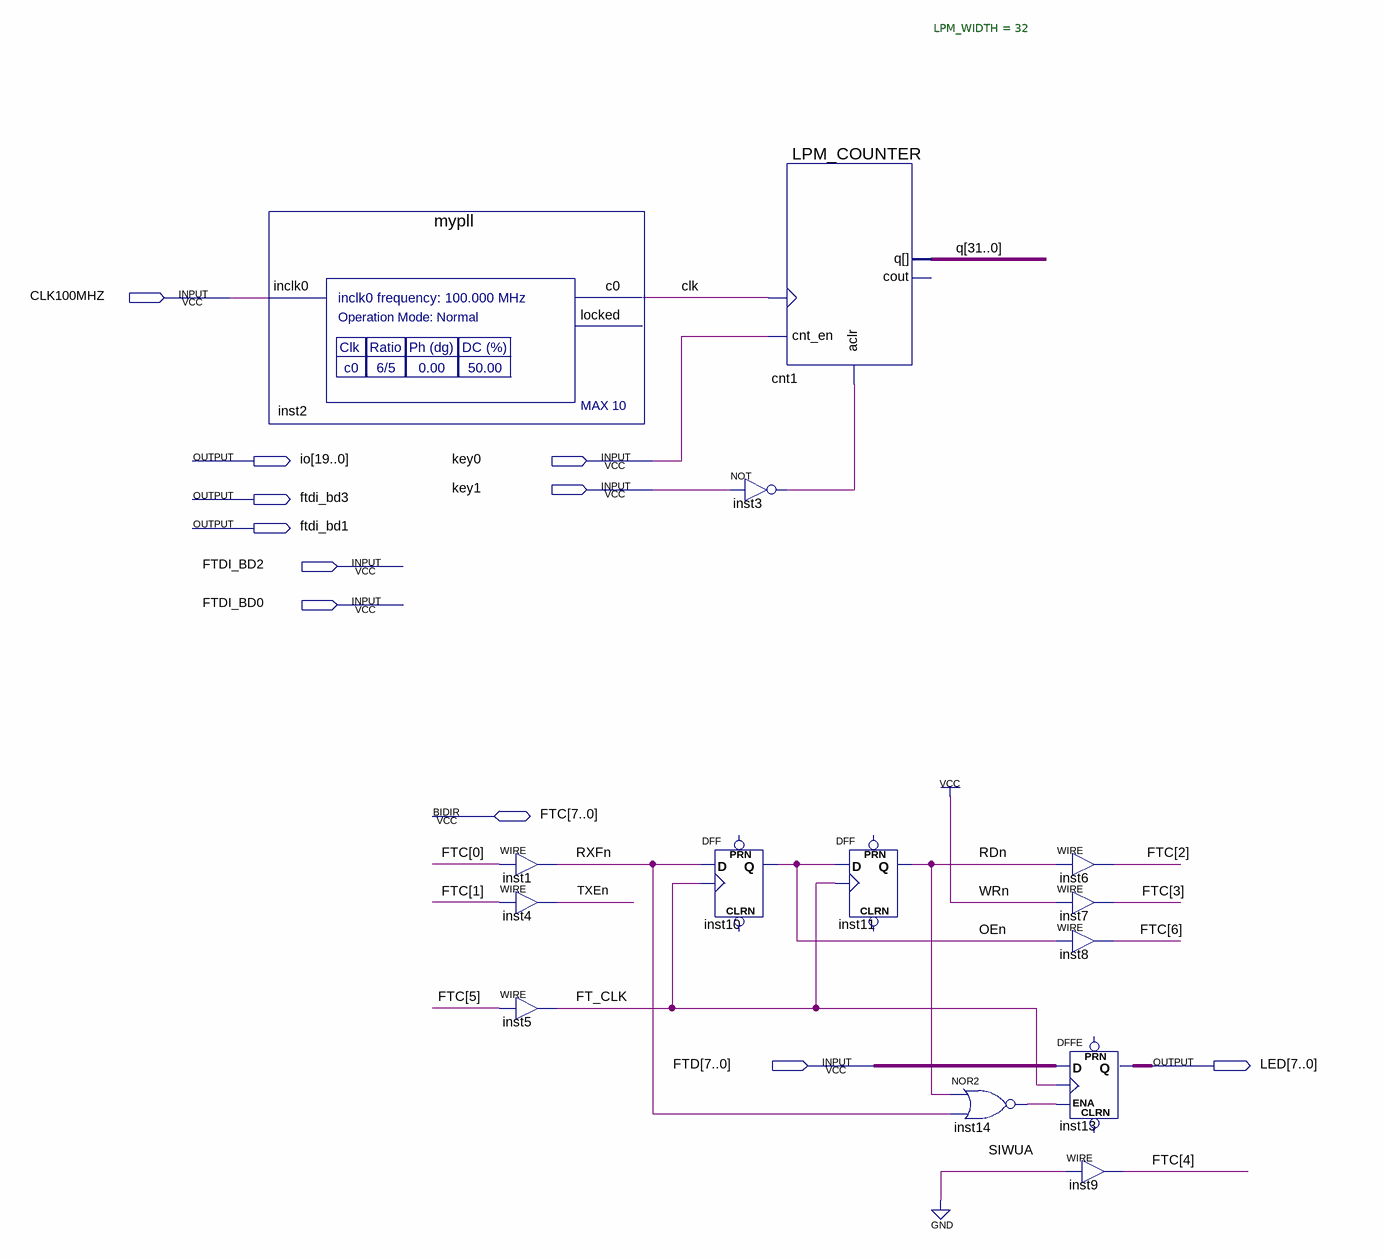
[diagram p0: schematic sheet]
// Quartus schematic max10.bdf as structural Verilog: 14 symbols, 11 pins
module max10 (
  input  CLK100MHZ,
  input  key0,
  input  key1,
  input  FTDI_BD2,
  input  FTDI_BD0,
  input  [7:0] FTD,
  inout  [7:0] FTC,
  output [19:0] io,
  output ftdi_bd3,
  output ftdi_bd1,
  output [7:0] LED
);

  wire clk, FT_CLK, inst3_out, inst14_out, OEn, RDn, RXFn, TXEn;
  wire [31:0] q;

  mypll inst2 (.inclk0(CLK100MHZ), .c0(clk));  // open: locked
  assign RXFn = FTC[0];  // WIRE inst1
  assign TXEn = FTC[1];  // WIRE inst4
  assign FT_CLK = FTC[5];  // WIRE inst5
  DFF inst10 (.CLK(FT_CLK), .D(RXFn), .Q(OEn));  // open: CLRN, PRN
  LPM_COUNTER #(.LPM_WIDTH(32)) cnt1 (.clock(clk), .aclr(inst3_out), .cnt_en(key0), .q(q));  // open: cout
  not inst3 (inst3_out, key1);
  DFF inst11 (.CLK(FT_CLK), .D(OEn), .Q(RDn));  // open: CLRN, PRN
  nor inst14 (inst14_out, RDn, RXFn);
  assign FTC[2] = RDn;  // WIRE inst6
  assign FTC[3] = 1'b1;  // WIRE inst7
  assign FTC[6] = OEn;  // WIRE inst8
  DFFE inst13[7:0] (.D(FTD), .CLK(FT_CLK), .ENA(inst14_out), .Q(LED));  // open: PRN, CLRN
  assign FTC[4] = 1'b0;  // WIRE inst9
endmodule
